# EAGLE design weather_box (EAGLE 7.7.0)
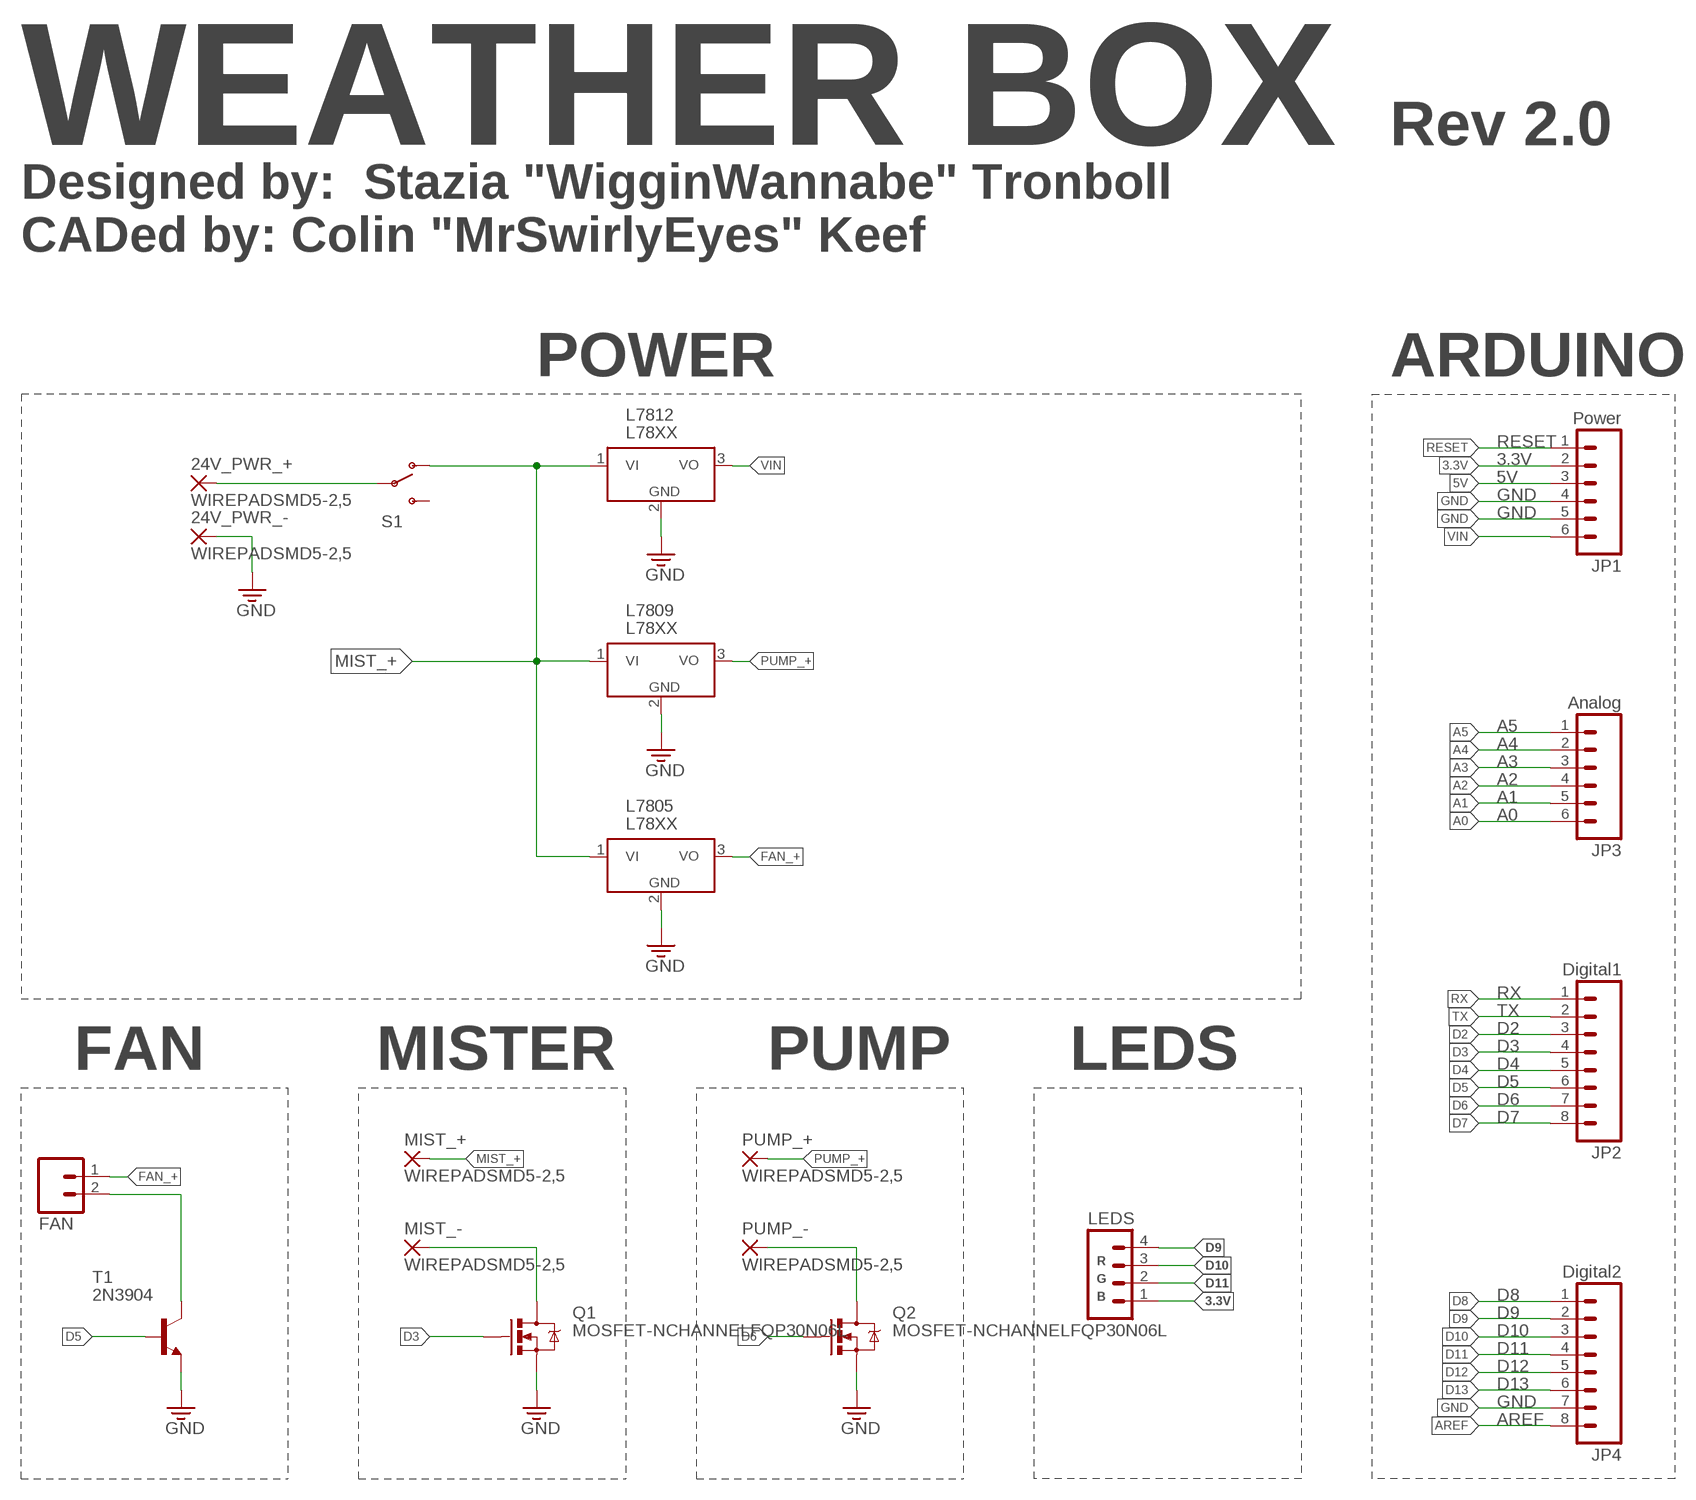
[diagram p0: schematic, sheet 1]

## Parts
24V_PWR_+  WIREPADSMD5-2,5  [5-2,5]
24V_PWR_-  WIREPADSMD5-2,5  [5-2,5]
FAN  M02PTH  [1X02]
JP1  Power  M06SIP  [1X06]
JP2  Digital1  M08  [1X08]
JP3  Analog  M06SIP  [1X06]
JP4  Digital2  M08  [1X08]
L7805  L78XX  [TO-220-HEATSINK]
L7809  L78XX  [TO-220-HEATSINK]
L7812  L78XX  [TO-220-HEATSINK]
LEDS  M04PTH  [1X04]
MIST_+  WIREPADSMD5-2,5  [5-2,5]
MIST_-  WIREPADSMD5-2,5  [5-2,5]
PUMP_+  WIREPADSMD5-2,5  [5-2,5]
PUMP_-  WIREPADSMD5-2,5  [5-2,5]
Q1  MOSFET-NCHANNELFQP30N06L  [TO220V]
Q2  MOSFET-NCHANNELFQP30N06L  [TO220V]
S1  SWITCH-SPDTPTH  [SWITCH-SPDT]
T1  2N3904  [TO92]

## Nets
3.3V: JP1.2 LEDS.1
5V [power]: JP1.3
A0: JP3.6
A1: JP3.5
A2: JP3.4
A3: JP3.3
A4: JP3.2
A5: JP3.1
AREF: JP4.8
D2: JP2.3
D3: JP2.4 Q1.1(G)
D4: JP2.5
D5: JP2.6 T1.2(B)
D6: JP2.7 Q2.1(G)
D7: JP2.8
D8: JP4.1
D9: JP4.2 LEDS.4
D10: JP4.3 LEDS.3
D11: JP4.4 LEDS.2
D12: JP4.5
D13: JP4.6
FAN_+: FAN.1 L7805.3(VO)
GND [power]: 24V_PWR_-.1(P) JP1.4 JP1.5 JP4.7 L7805.2(GND) L7809.2(GND) L7812.2(GND) Q1.3(S) Q2.3(S) T1.3(E)
MIST_+: L7805.1(VI) L7809.1(VI) L7812.1(VI) MIST_+.1(P) S1.1(O)
N$1: 24V_PWR_+.1(P) S1.2(P)
N$2: MIST_-.1(P) Q1.2(D)
N$3: FAN.2 T1.1(C)
N$4: PUMP_-.1(P) Q2.2(D)
PUMP_+: L7809.3(VO) PUMP_+.1(P)
RESET: JP1.1
RX: JP2.1
TX: JP2.2
VIN: JP1.6 L7812.3(VO)
Unconnected: S1.3(S)

## Notes on the sheet
- WEATHER BOX | Rev 2.0
- Designed by:  Stazia "WigginWannabe" Tronboll
  CADed by: Colin "MrSwirlyEyes" Keef
- POWER | ARDUINO
- FAN | MISTER | PUMP | LEDS
- R
- G
- B

## Library data of the parts
24V_PWR_+ 24V_PWR_- MIST_+ MIST_- PUMP_+ PUMP_- = wirepad:WIREPAD: Wire PAD connect wire on PCB
FAN = SparkFun-Connectors:M02: Standard 2-pin 0.1" header. Use with - straight break away headers ( PRT-00116) - right angle break away headers (PRT-00553) - swiss pins (PRT-00743) - machine pins (PRT-00117) - female headers (PRT-00115) Molex polarized connector foot print use with: PRT-08233 with associated crimp pins and housings. 2.54_SCREWTERM for use with PRT-10571. 3.5mm Screw Terminal footprints for PRT-08084 5mm Screw Terminal footprints for use with PRT-08432
JP1 JP3 = SparkFun:M06: Header 6 Standard 6-pin 0.1" header. Use with straight break away headers (SKU : PRT-00116), right angle break away headers (PRT-00553), swiss pins (PRT-00743), machine pins (PRT-00117), and female headers (PRT-00115). Molex polarized connector foot print use with SKU : PRT-08094 with associated crimp pins and housings. NOTES ON THE VARIANTS LOCK and LOCK_LONGPADS... This footprint was designed to help hold the alignment of a through-hole component (i.e. 6-pin header) while soldering it into place. You may notice that each hole has been shifted either up or down by 0.005 of an inch from it's more standard position (which is a perfectly straight line). This slight alteration caused the pins (the squares in the middle) to touch the edges of the holes. Because they are alternating, it causes a "brace" to hold the component in place. 0.005 has proven to be the perfect amount of "off-center" position when using our standard breakaway headers. Although looks a little odd when you look at the bare footprint, once you have a header in there, the alteration is very hard to notice. Also, if you push a header all the way into place, it is covered up entirely on the bottom side. This idea of altering the position of holes to aid alignment will be further integrated into the Sparkfun Library for other footprints. It can help hold any component with 3 or more connection pins.
JP2 JP4 = SparkFun:M08: Header 8 Standard 8-pin 0.1" header. Use with straight break away headers (SKU : PRT-00116), right angle break away headers (PRT-00553), swiss pins (PRT-00743), machine pins (PRT-00117), and female headers (PRT-00115).
L7805 L7809 L7812 = GP:L78XX
LEDS = SparkFun-Connectors:M04: Header 4 Standard 4-pin 0.1" header. Use with straight break away headers (SKU : PRT-00116), right angle break away headers (PRT-00553), swiss pins (PRT-00743), machine pins (PRT-00117), and female headers (PRT-00115). Molex polarized connector foot print use with SKU : PRT-08231 with associated crimp pins and housings. 1MM SMD Version SKU: PRT-10208; PROD_ID: CONN-09696
Q1 Q2 = SparkFun-DiscreteSemi:MOSFET-NCHANNEL: Common NMOSFET Parts MFG P/N Store ID Prod ID FDD8780 TRANS-09984 SI7820DN TRANS-11055 FDS6630A IC-08089 2N7002PW TRANS-11151 FQP30N06L COM-10213 TRANS-10060 BSS123LT1G TRANS-08345 BSS138 TRANS-00830 BS170 2N7000; PROD_ID: TRANS-10060
S1 = SparkFun-Electromechanical:SWITCH-SPDT: SPDT Switch Simple slide switch, Spark Fun Electronics SKU : COM-00102 DPDT SMT slide switch, AYZ0202, SWCH-08179; PROD_ID: SWCH-08261
T1 = transistor:2N3904: NPN TRANSISTOR

## Net classes
1 power: width 0.254 mm

## Board
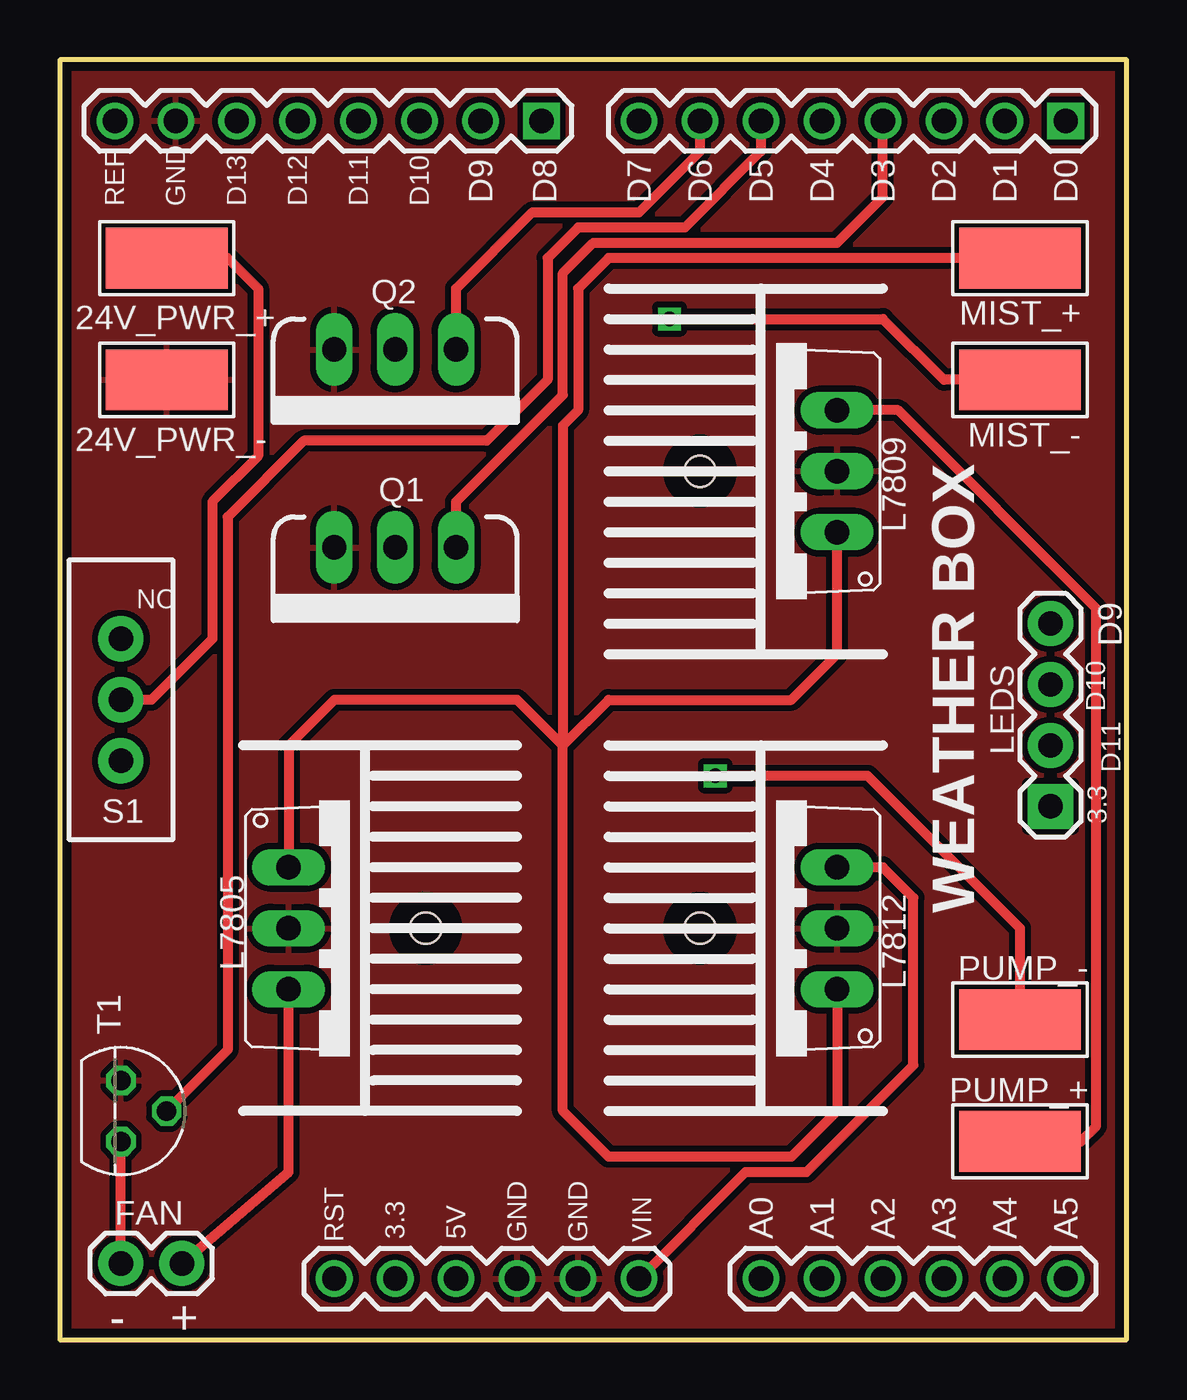
[diagram p1: board, top side]
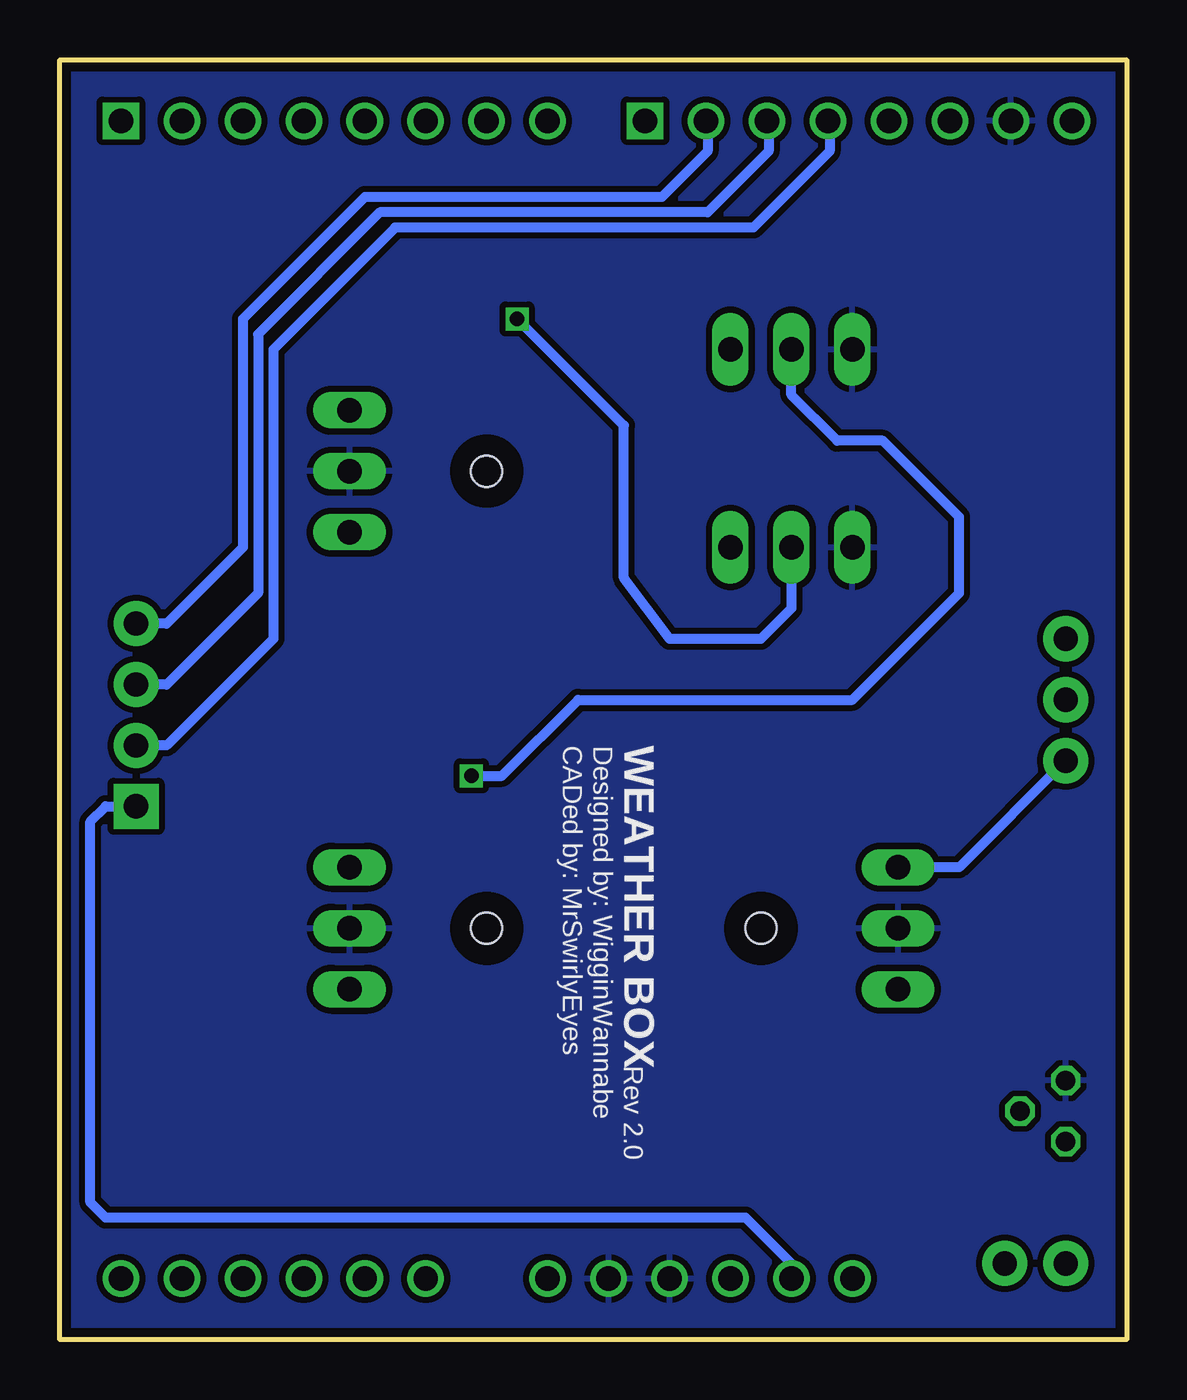
[diagram p2: board, bottom side, seen from below]

Size 44.45 x 53.34 mm. Coordinates in mm from the lower left corner, seen from the top.
Outline: 0,53.34 0,0 44.45,0 44.45,53.34 0,53.34
Copper layers (1*16): Top 0.0356mm / dielectric 1.5011mm / Bottom 0.0356mm
Design rules "oshpark-2layer": minimum track width 6mil, minimum drill 13mil, track to track 6mil, track to pad 6mil, pad to pad 6mil, via to via 6mil, smd to smd 6mil, copper to edge 15mil, drill to drill 6mil, minimum pad ring 7mil, minimum via ring 7mil, stop-mask expansion 2.5mil, vias tented up to drill 0mil, thermal gap 10mil

### Footprints (pad centres in the part's own frame; a part is rotated, then mirrored left to right if it is on the bottom)
5-2,5 = smd 2.54 x 5.08: 1 0,0
1X02 = drill 1.016 pad 1.88: 1 0,0; 2 2.54,0
1X06 = drill 1.016: 1 0,0; 2 2.54,0; 3 5.08,0; 4 7.62,0; 5 10.16,0; 6 12.7,0
1X08 = drill 1.016 square: 1 0,0 | drill 1.016: 2 2.54,0; 3 5.08,0; 4 7.62,0; 5 10.16,0; 6 12.7,0; 7 15.24,0; 8 17.78,0
TO-220-HEATSINK = drill 1.016 long: 1 -2.54,0; 2 0,0; 3 2.54,0 | hole 1.3: 0,5.715
1X04 = drill 1.016 pad 1.88 square: 1 0,0 | drill 1.016 pad 1.88: 2 2.54,0; 3 5.08,0; 4 7.62,0
TO220V = drill 1.016 long: 1 -2.54,0; 2 0,0; 3 2.54,0
SWITCH-SPDT = drill 1.016 pad 1.88: 1 0,2.54; 2 0,0; 3 0,-2.54
TO92 = drill 0.813 octagon: 1 1.27,0; 2 0,1.905; 3 -1.27,0

### Placement (x,y rotation side)
24V_PWR_+  4.45,45.09 90 top
24V_PWR_-  4.45,40.01 90 top
FAN  5.08,3.17 180 top
JP1  11.43,2.54 0 top
JP2  41.91,50.8 180 top
JP3  41.91,2.54 180 top
JP4  20.07,50.8 180 top
L7805  9.53,17.14 270 top
L7809  32.38,36.2 90 top
L7812  32.38,17.14 90 top
LEDS  41.27,22.23 90 top
MIST_+  40.01,45.09 90 top
MIST_-  40.01,40.01 90 top
PUMP_+  40.01,8.26 90 top
PUMP_-  40.01,13.34 90 top
Q1  13.97,33.02 180 top
Q2  13.97,41.27 180 top
S1  2.54,26.67 180 top
T1  2.54,9.53 270 top

### Tracks (layer width: path | path; a pad name or v marks a point on that pad's centre or on a via)
3.3V
  Bottom 0.406: JP1.2 13.97,3.17 15.88,5.08 42.55,5.08 43.18,5.71 43.18,21.59 42.55,22.23 LEDS.1
D3
  Top 0.406: Q1.1 16.51,34.92 20.95,39.37 20.95,44.45 22.23,45.72 32.38,45.72 34.29,47.62 JP2.4
D5
  Top 0.406: JP2.6 29.21,49.53 26.04,46.35 21.59,46.35 20.32,45.09 20.32,40.01 17.78,37.47 10.16,37.47 6.99,34.29 6.99,12.06 T1.2
D6
  Top 0.406: Q2.1 16.51,43.81 19.68,46.99 24.13,46.99 26.67,49.53 JP2.7
D9
  Bottom 0.406: JP4.2 17.46,50.74 17.46,49.53 19.37,47.62 31.75,47.62 36.83,42.55 36.83,33.02 40.01,29.84 LEDS.4
D10
  Bottom 0.406: JP4.3 14.92,50.74 14.92,49.53 17.46,46.99 31.11,46.99 36.2,41.91 36.2,31.11 40.01,27.3 LEDS.3
D11
  Bottom 0.406: JP4.4 12.38,50.74 12.38,49.53 15.56,46.35 30.48,46.35 35.56,41.27 35.56,29.21 40.01,24.77 LEDS.2
FAN_+
  Top 0.406: FAN.1 9.53,6.99 L7805.3
GND
  pour Bottom (isolate 0.254): 44.45,53.34 44.45,0 0,0 0,53.34
  pour Top (isolate 0.254): 44.45,53.34 44.45,0 0,0 0,53.34
MIST_+
  Top 0.406: L7812.1 32.38,9.53 30.48,7.62 22.86,7.62 20.95,9.53 20.95,24.77 | 20.95,24.77 19.05,26.67 11.43,26.67 9.53,24.77 L7805.1 | 20.95,24.77 22.86,26.67 30.48,26.67 32.38,28.57 L7809.1 | MIST_+.1 22.86,45.09 21.59,43.81 21.59,38.73 20.95,38.1 20.95,24.77
  Bottom 0.406: S1.1 6.99,19.68 L7805.1
N$1
  Top 0.406: 24V_PWR_+.1 6.99,45.09 8.26,43.81 8.26,36.83 6.35,34.92 6.35,29.21 3.81,26.67 S1.2
N$2  (via drill 0.6)
  Top 0.406: MIST_-.1 36.83,40.01 34.29,42.55 v25.4,42.55
  Bottom 0.406: Q1.2 13.97,30.48 15.24,29.21 19.05,29.21 20.95,31.75 20.95,38.1 v25.4,42.55
N$3
  Top 0.406: FAN.2 T1.1
N$4  (via drill 0.6)
  Top 0.406: PUMP_-.1 40.01,17.14 33.66,23.5 v27.3,23.5
  Bottom 0.406: v27.3,23.5 26.04,23.5 22.86,26.67 11.43,26.67 6.99,31.11 6.99,34.29 10.16,37.47 12.06,37.47 13.97,39.37 Q2.2
PUMP_+
  Top 0.406: PUMP_+.1 42.55,8.26 43.18,8.89 43.18,30.48 34.92,38.73 L7809.3
VIN
  Top 0.406: JP1.6 28.57,6.99 31.11,6.99 35.56,11.43 35.56,18.41 34.29,19.68 L7812.3

### Text on the board
tPlace: REF | GND | D13 | D12 | D11 | D10 | D9 | D8 | D7 | D6 | D5 | D4 | D3 | D2 | D1 | D0 | D9 | NC | D10 | D11 | 3.3 | WEATHER BOX | RST | 3.3 | 5V | GND | GND | VIN | A0 | A1 | A2 | A3 | A4 | A5 | - | +
bPlace: WEATHER BOX | Designed by: WigginWannabe | CADed by: MrSwirlyEyes | Rev 2.0